# EAGLE design mainboard (EAGLE 8.2.2)
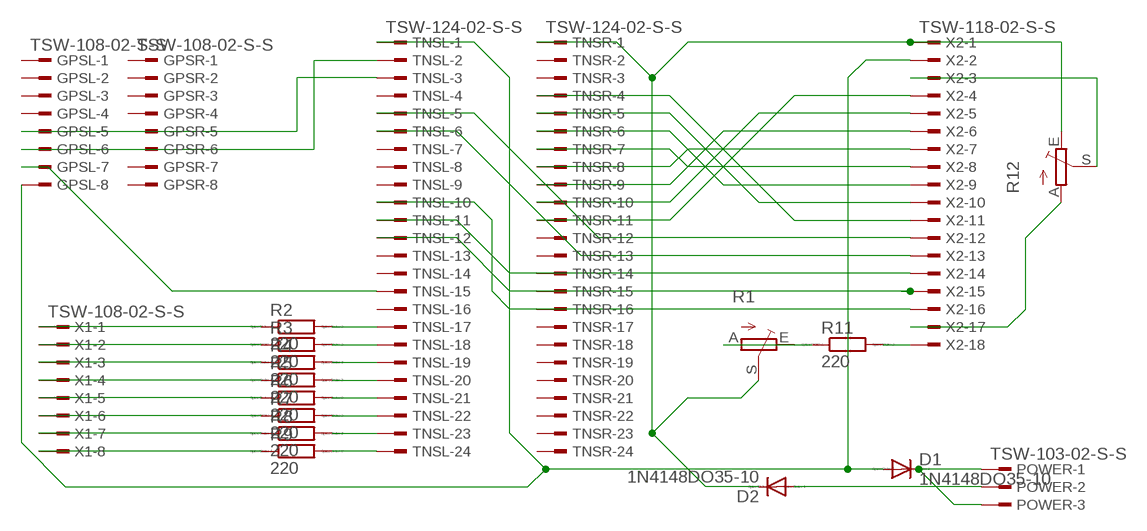
[diagram p0: schematic, sheet 1]

## Parts
D1  1N4148DO35-10  [DO35-10]
D2  1N4148DO35-10  [DO35-10]
GPSL  TSW-108-02-S-S  [TSW-108-02-S-S]
GPSR  TSW-108-02-S-S  [TSW-108-02-S-S]
POWER  TSW-103-02-S-S  [TSW-103-02-S-S]
R1  TRIM_EU-CA6V  [CA6V]
R2  220  R0207/10  [0207/10]
R3  220  R0207/10  [0207/10]
R4  220  R0207/10  [0207/10]
R5  220  R0207/10  [0207/10]
R6  220  R0207/10  [0207/10]
R7  220  R0207/10  [0207/10]
R8  220  R0207/10  [0207/10]
R9  220  R0207/10  [0207/10]
R11  220  R0207/10  [0207/10]
R12  TRIM_EU-CA6V  [CA6V]
TNSL  TSW-124-02-S-S  [TSW-124-02-S-S]
TNSR  TSW-124-02-S-S  [TSW-124-02-S-S]
X1  TSW-108-02-S-S  [TSW-108-02-S-S]
X2  TSW-118-02-S-S  [TSW-118-02-S-S]

## Nets
GND: D1.A GPSL.8 TNSL.1 X2.2
N$1: GPSL.5 TNSL.3
N$2: R12.S X2.3
N$3: GPSL.6 TNSL.2
N$4: R12.A X2.17
N$5: TNSR.11 X2.4
N$6: TNSR.10 X2.5
N$7: TNSR.9 X2.6
N$8: TNSR.8 X2.7
N$9: TNSR.7 X2.8
N$10: TNSR.6 X2.9
N$11: TNSR.5 X2.10
N$12: TNSR.4 X2.11
N$13: TNSL.5 X2.12
N$14: TNSL.6 X2.13
N$15: TNSL.11 X2.14
N$16: TNSL.12 X2.15
N$17: TNSL.10 X2.16
N$18: R9.2 TNSL.24
N$19: R8.2 TNSL.23
N$20: R7.2 TNSL.22
N$21: R6.2 TNSL.21
N$22: R5.2 TNSL.20
N$23: R4.2 TNSL.19
N$24: R3.2 TNSL.18
N$25: R2.2 TNSL.17
N$26: R2.1 X1.1
N$27: R3.1 X1.2
N$28: R4.1 X1.3
N$29: R5.1 X1.4
N$30: R6.1 X1.5
N$31: R7.1 X1.6
N$32: R8.1 X1.7
N$33: R9.1 X1.8
N$34: D1.C POWER.1 POWER.3
N$35: R1.A R11.1
N$36: D2.A POWER.2
N$39: R11.2 X2.18
N$41: GPSL.7 TNSL.15
N$42: D2.C R1.S R12.E TNSR.1 X2.1
Unconnected: GPSL.1 GPSL.2 GPSL.3 GPSL.4 GPSR.1 GPSR.2 GPSR.3 GPSR.4 GPSR.5 GPSR.6 GPSR.7 GPSR.8 R1.E TNSL.4 TNSL.7 TNSL.8 TNSL.9 TNSL.13 TNSL.14 TNSL.16 TNSR.2 TNSR.3 TNSR.12 TNSR.13 TNSR.14 TNSR.15 TNSR.16 TNSR.17 TNSR.18 TNSR.19 TNSR.20 TNSR.21 TNSR.22 TNSR.23 TNSR.24

## Library data of the parts
D1 D2 = diode:1N4148: DIODE high speed (Philips)
GPSL GPSR X1 = con-samtec:TSW-108-02-S-S: THROUGH-HOLE .025" SQ POST HEADER Source: Samtec TSW.pdf; OC_FARNELL: unknown; OC_NEWARK: unknown
POWER = con-samtec:TSW-103-02-S-S: THROUGH-HOLE .025" SQ POST HEADER Source: Samtec TSW.pdf; OC_FARNELL: unknown; OC_NEWARK: unknown
R1 R12 = pot:TRIM_EU-: POTENTIOMETER
R2-R9 R11 = eagle-ltspice:R: RESISTOR, European symbol; SPICEMODEL: NONE; SPICEPREFIX: R
TNSL TNSR = con-samtec:TSW-124-02-S-S: THROUGH-HOLE .025" SQ POST HEADER Source: Samtec TSW.pdf; OC_FARNELL: unknown; OC_NEWARK: unknown
X2 = con-samtec:TSW-118-02-S-S: THROUGH-HOLE .025" SQ POST HEADER Source: Samtec TSW.pdf; OC_FARNELL: unknown; OC_NEWARK: unknown

## Board
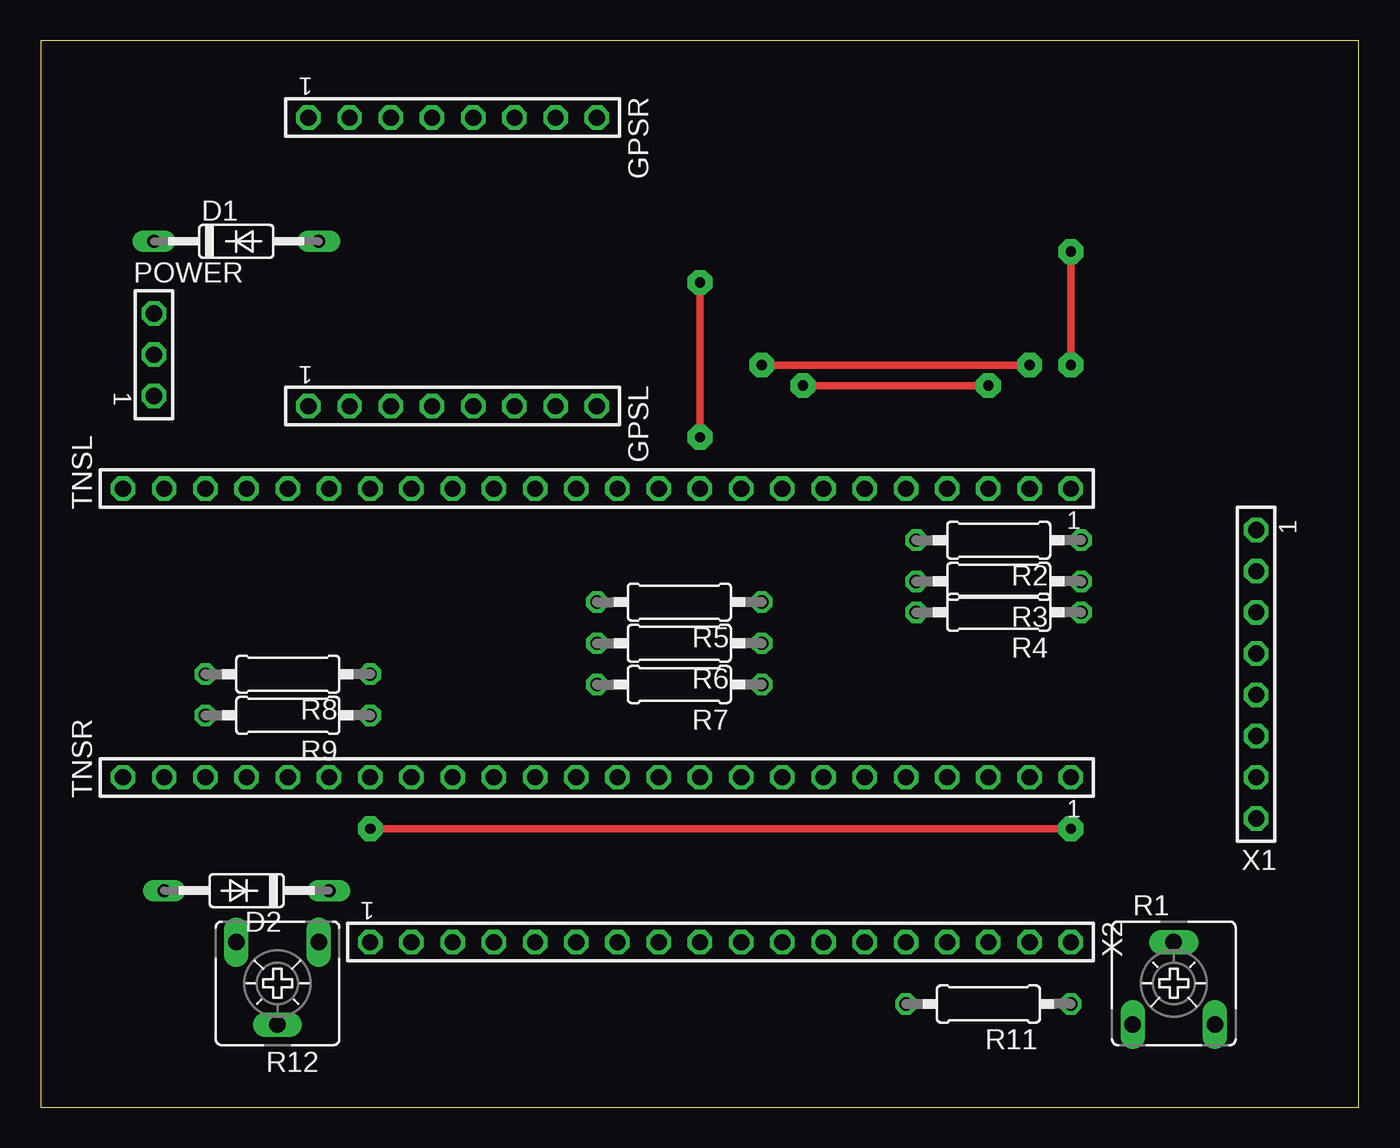
[diagram p1: board, top side]
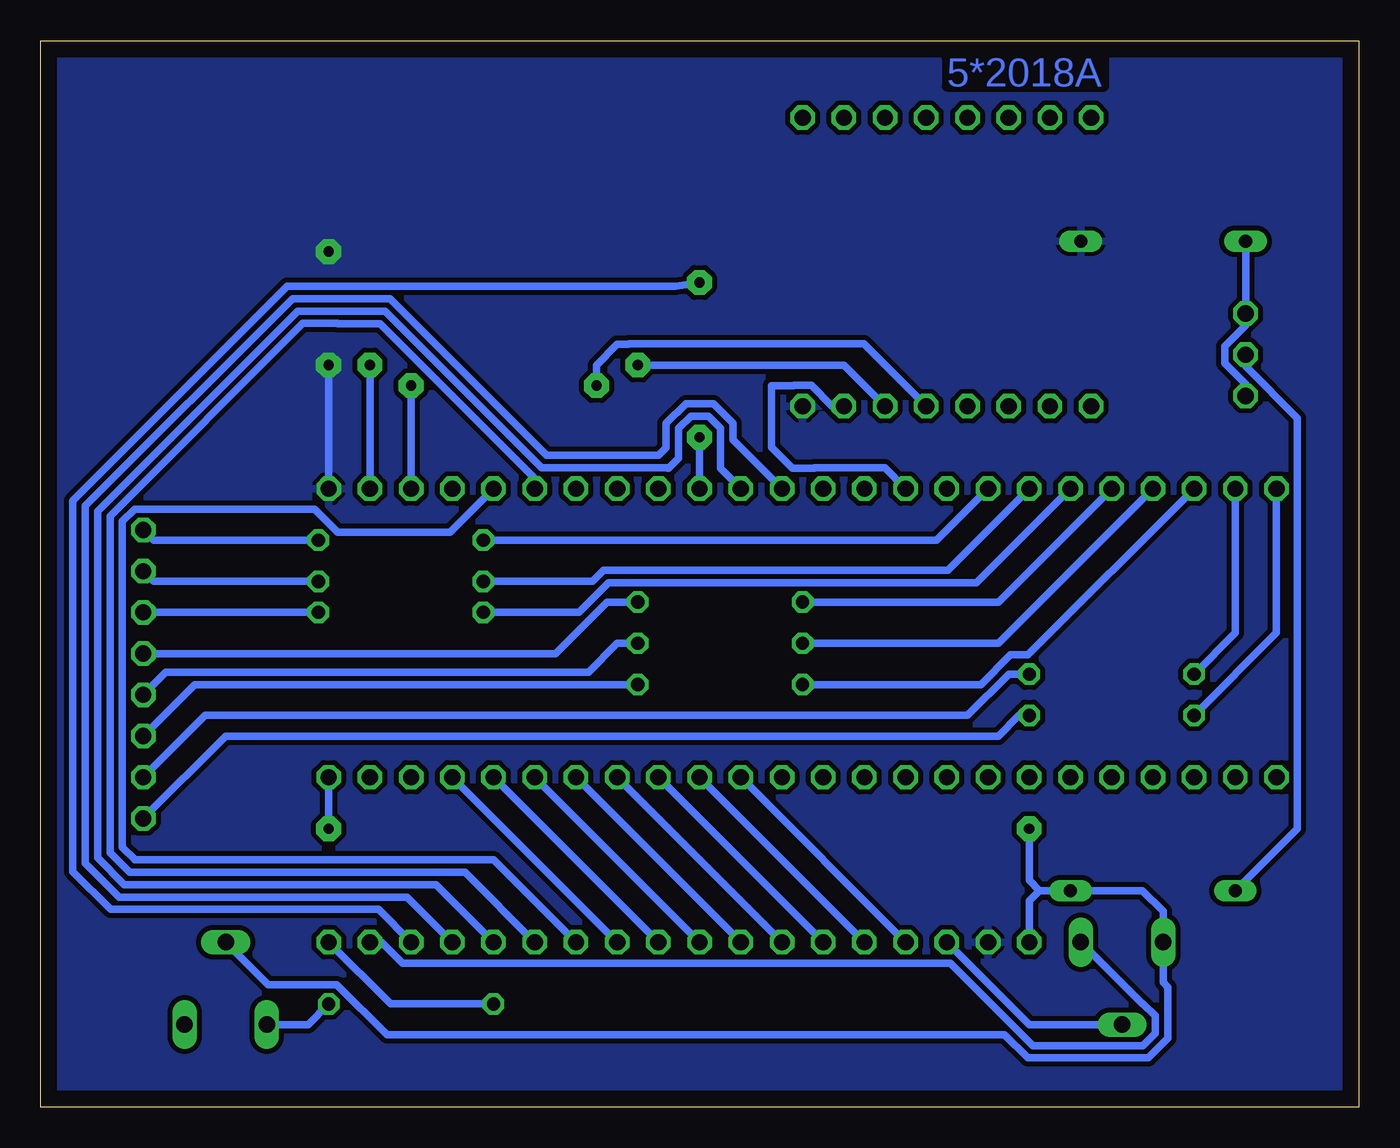
[diagram p2: board, bottom side, seen from below]

Size 81.26 x 65.71 mm. Coordinates in mm from the lower left corner, seen from the top.
Outline: 0,0 81.26,0 81.26,65.71 0,65.71 0,0
Copper layers (1*16): Top 0.035mm / dielectric 1.5mm / Bottom 0.035mm
Design rules "default *": minimum track width 18mil, minimum drill 0.35mm, track to track 12mil, track to pad 12mil, pad to pad 6mil, via to via 18mil, smd to smd 6mil, copper to edge 40mil, drill to drill 6mil, minimum pad ring 10mil, minimum via ring 8mil, stop-mask expansion 4mil, vias tented up to drill 0mil, thermal gap 10mil

### Footprints (pad centres in the part's own frame; a part is rotated, then mirrored left to right if it is on the bottom)
DO35-10 = drill 0.813 long: A 5.08,0; C -5.08,0
TSW-108-02-S-S = drill 1 pad 1.5 octagon: 1 8.89,0; 2 6.35,0; 3 3.81,0; 4 1.27,0; 5 -1.27,0; 6 -3.81,0; 7 -6.35,0; 8 -8.89,0
TSW-103-02-S-S = drill 1 pad 1.5 octagon: 1 2.54,0; 2 0,0; 3 -2.54,0
CA6V = drill 1.016 long: A -2.54,-2.54; E 2.54,-2.54; S 0,2.54
0207/10 = drill 0.813 octagon: 1 -5.08,0; 2 5.08,0
TSW-124-02-S-S = drill 1 pad 1.5 octagon: 1 29.21,0; 2 26.67,0; 3 24.13,0; 4 21.59,0; 5 19.05,0; 6 16.51,0; 7 13.97,0; 8 11.43,0; 9 8.89,0; 10 6.35,0; 11 3.81,0; 12 1.27,0; 13 -1.27,0; 14 -3.81,0; 15 -6.35,0; 16 -8.89,0; 17 -11.43,0; 18 -13.97,0; 19 -16.51,0; 20 -19.05,0; 21 -21.59,0; 22 -24.13,0; 23 -26.67,0; 24 -29.21,0
TSW-118-02-S-S = drill 1 pad 1.5 octagon: 1 21.59,0; 2 19.05,0; 3 16.51,0; 4 13.97,0; 5 11.43,0; 6 8.89,0; 7 6.35,0; 8 3.81,0; 9 1.27,0; 10 -1.27,0; 11 -3.81,0; 12 -6.35,0; 13 -8.89,0; 14 -11.43,0; 15 -13.97,0; 16 -16.51,0; 17 -19.05,0; 18 -21.59,0

### Placement (x,y rotation side)
D1  12.07,53.34 0 top
D2  12.7,13.33 180 top
GPSL  25.4,43.18 180 top
GPSR  25.4,60.96 180 top
POWER  6.98,46.36 270 top
R1  69.85,7.62 0 top
R2  59.06,34.92 180 top
R3  59.06,32.38 180 top
R4  59.06,30.48 180 top
R5  39.37,31.11 180 top
R6  39.37,28.58 180 top
R7  39.37,26.03 180 top
R8  15.24,26.67 180 top
R9  15.24,24.13 180 top
R11  58.42,6.35 180 top
R12  14.61,7.62 180 top
TNSL  34.29,38.1 0 top
TNSR  34.29,20.32 0 top
X1  74.93,26.67 90 top
X2  41.91,10.16 180 top

### Tracks (layer width: path | path; a pad name or v marks a point on that pad's centre or on a via)
GND  (via drill 0.64 pad 1.52)
  Top 0.457: v63.5,45.72 v63.5,52.7
  Bottom 0.457: TNSL.1 v63.5,45.72
  pour Bottom: 0,66.04 81.28,66.04 81.28,0 0,0
N$1  (via drill 0.64 pad 1.52)
  Top 0.457: v58.42,44.45 v46.99,44.45
  Bottom 0.457: TNSL.3 v58.42,44.45 | v46.99,44.45 46.99,45.72 45.72,46.99 45.01,46.99 44.99,47.02 30.5,47.02 GPSL.5
N$2
  Bottom 0.457: R12.S 20.32,5.08 X2.3
N$3  (via drill 0.64 pad 1.52)
  Top 0.457: v60.96,45.72 v44.45,45.72
  Bottom 0.457: TNSL.2 v60.96,45.72 | v44.45,45.72 31.75,45.72 GPSL.6
N$4
  Bottom 0.457: X2.17 60.24,10.16 58.95,8.87 25.19,8.87 20.1,3.78 13.31,3.78 12.55,4.54 12.55,5.62 13.31,6.38 13.36,6.38 R12.A
N$5
  Bottom 0.457: X2.4 TNSR.11
N$6
  Bottom 0.457: X2.5 TNSR.10
N$7
  Bottom 0.457: X2.6 TNSR.9
N$8
  Bottom 0.457: X2.7 TNSR.8
N$9
  Bottom 0.457: X2.8 TNSR.7
N$10
  Bottom 0.457: X2.9 TNSR.6
N$11
  Bottom 0.457: X2.10 TNSR.5
N$12
  Bottom 0.457: X2.11 TNSR.4
N$13
  Bottom 0.457: TNSL.5 56.02,35.42 62.94,35.42 64.37,36.85 75.46,36.85 76.22,36.09 76.22,16 75.44,15.22 | X2.12 53.32,15.22 75.44,15.22 | 75.44,15.22 75.46,15.22
N$14
  Bottom 0.457: 76.98,16.93 76.98,17.14 | 76.98,17.14 76.98,36.41 65.1,48.28 62.96,48.28 62.94,48.26 60.33,48.26 50.8,38.73 TNSL.6 | X2.13 55.1,14.46 75.78,14.46 76.98,15.66 76.98,17.14
N$15
  Bottom 0.457: 58.15,13.7 58.42,13.7 | 58.42,13.7 76.09,13.7 77.74,15.34 77.74,36.72 65.42,49.05 60.03,49.05 50.38,39.39 42.65,39.39 42.63,39.37 42.55,39.37 41.94,39.98 41.94,41.81 41.18,42.57 40.1,42.57 39.34,41.81 39.34,39.34 TNSL.11 | 58.42,13.7 56.88,13.7 X2.14
N$16
  Bottom 0.457: 78.5,16.3 78.5,16.51 | 78.5,16.51 78.5,37.04 65.73,49.81 59.72,49.81 50.06,40.15 43.18,40.15 42.7,40.63 42.7,42.13 41.49,43.33 39.79,43.33 38.58,42.13 38.58,41.12 TNSL.12 | X2.15 58.66,12.94 76.41,12.94 78.5,15.03 78.5,16.51
N$17  (via drill 0.64 pad 1.52)
  Top 0.457: v40.64,50.8 v40.64,41.27
  Bottom 0.457: TNSL.10 v40.64,41.27 | v40.64,50.8 42.14,50.57 66.05,50.57 79.27,37.36 79.27,14.49 76.95,12.17 60.44,12.17 X2.16
N$18
  Bottom 0.457: TNSL.24 5.08,29.21 R9.2
N$19
  Bottom 0.457: TNSL.23 7.62,29.21 R8.2
N$20
  Bottom 0.457: R7.2 23.3,26.03 21.47,27.86 20.4,27.86 TNSL.22
N$21
  Bottom 0.457: R6.2 22.22,28.58 TNSL.21
N$22
  Bottom 0.457: R5.2 22.22,31.11 TNSL.20
N$23
  Bottom 0.457: R4.2 48.07,30.48 46.24,32.31 23.57,32.31 TNSL.19
N$24
  Bottom 0.457: R3.2 47.24,32.38 46.55,33.07 25.35,33.07 TNSL.18
N$25
  Bottom 0.457: R2.2 26.04,34.92 TNSL.17
N$26
  Bottom 0.457: R2.1 74.3,34.92 X1.1
N$27
  Bottom 0.457: R3.1 74.3,32.38 X1.2
N$28
  Bottom 0.457: R4.1 X1.3
N$29
  Bottom 0.457: R5.1 46.36,31.11 49.53,27.94 X1.4
N$30
  Bottom 0.457: R6.1 45.72,28.58 47.5,26.8 73.53,26.8 X1.5
N$31
  Bottom 0.457: R7.1 71.76,26.03 X1.6
N$32
  Bottom 0.457: R8.1 21.59,26.67 24.13,24.13 71.12,24.13 X1.7
N$33
  Bottom 0.457: R9.1 20.95,24.13 22.22,22.86 69.85,22.86 X1.8
N$34
  Bottom 0.457: D1.C POWER.3 6.98,48.18 8.27,46.89 8.27,45.82 6.98,44.53 POWER.1
N$35
  Bottom 0.457: R1.A 64.77,5.08 R11.1
N$36
  Bottom 0.457: POWER.2 6.98,45.64 3.79,42.44 3.79,17.16 D2.A
N$39
  Bottom 0.457: R11.2 59.69,6.35 X2.18
N$41
  Bottom 0.457: GPSL.7 32.47,43.18 33.76,44.47 34.82,44.47 34.84,44.45 36.19,44.45 36.19,40.64 34.92,39.37 33.57,39.37 33.55,39.39 29.23,39.39 TNSL.15
N$42  (via drill 0.64 pad 1.52)
  Top 0.457: v63.5,17.14 v20.32,17.14
  Bottom 0.457: 19.68,13.33 D2.C 13.34,13.33 12.07,12.06 R12.E 12.07,7.67 11.79,7.39 11.79,4.23 12.99,3.02 20.42,3.02 21.84,4.45 59.91,4.45 63.01,7.54 67.23,7.54 R1.S | 19.68,13.33 20.32,12.7 X2.1 | v20.32,17.14 20.32,13.97 19.68,13.33 | v63.5,17.14 TNSR.1

### Text on the board
Bottom: 5*2018A